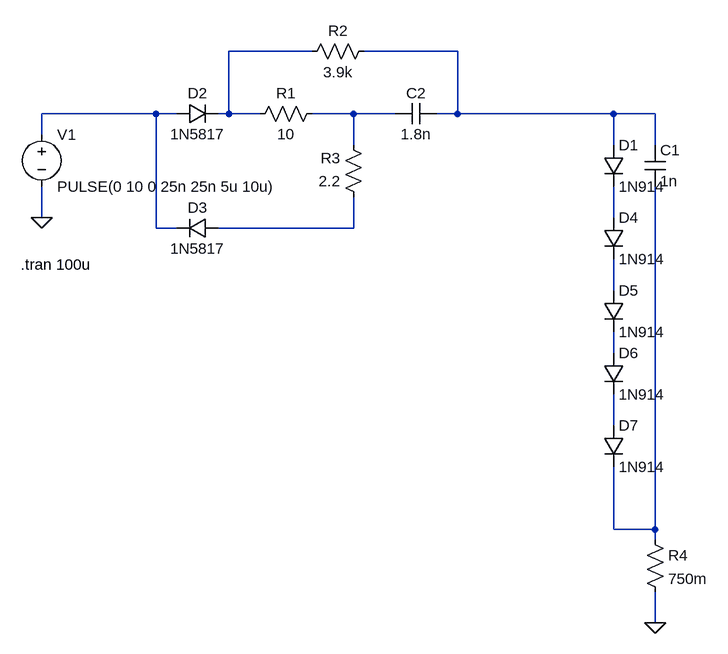
[diagram p0: schematic gate_drive.asc]
gate_drive.asc, the LTspice schematic file:
Version 4.1
SHEET 1 880 868
WIRE -32 -32 -160 -32
WIRE 192 -32 48 -32
WIRE -272 64 -448 64
WIRE -240 64 -272 64
WIRE -160 64 -160 -32
WIRE -160 64 -176 64
WIRE -112 64 -160 64
WIRE 32 64 -32 64
WIRE 96 64 32 64
WIRE 192 64 192 -32
WIRE 192 64 160 64
WIRE 432 64 192 64
WIRE 496 64 432 64
WIRE -448 96 -448 64
WIRE 32 112 32 64
WIRE 432 112 432 64
WIRE 496 112 496 64
WIRE -448 224 -448 176
WIRE 432 224 432 176
WIRE -272 240 -272 64
WIRE -240 240 -272 240
WIRE 32 240 32 192
WIRE 32 240 -176 240
WIRE 432 336 432 288
WIRE 432 432 432 400
WIRE 432 544 432 496
WIRE 432 704 432 608
WIRE 496 704 496 176
WIRE 496 704 432 704
WIRE 496 720 496 704
WIRE 496 848 496 800
FLAG -448 224 0
FLAG 496 848 0
SYMBOL cap 480 112 R0
SYMATTR InstName C1
SYMATTR Value 1n
SYMBOL diode 416 112 R0
SYMATTR InstName D1
SYMATTR Value 1N914
SYMBOL diode -240 80 R270
WINDOW 0 32 32 VTop 2
WINDOW 3 0 32 VBottom 2
SYMATTR InstName D2
SYMATTR Value 1N5817
SYMBOL diode -176 224 R90
WINDOW 0 0 32 VBottom 2
WINDOW 3 32 32 VTop 2
SYMATTR InstName D3
SYMATTR Value 1N5817
SYMBOL res -16 48 R90
WINDOW 0 0 56 VBottom 2
WINDOW 3 32 56 VTop 2
SYMATTR InstName R1
SYMATTR Value 10
SYMBOL res 64 -48 R90
WINDOW 0 0 56 VBottom 2
WINDOW 3 32 56 VTop 2
SYMATTR InstName R2
SYMATTR Value 3.9k
SYMBOL res 48 208 R180
WINDOW 0 36 76 Left 2
WINDOW 3 36 40 Left 2
SYMATTR InstName R3
SYMATTR Value 2.2
SYMBOL cap 160 48 R90
WINDOW 0 0 32 VBottom 2
WINDOW 3 32 32 VTop 2
SYMATTR InstName C2
SYMATTR Value 1.8n
SYMBOL voltage -448 80 R0
WINDOW 123 0 0 Left 0
WINDOW 39 0 0 Left 0
SYMATTR InstName V1
SYMATTR Value PULSE(0 10 0 25n 25n 5u 10u)
SYMBOL diode 416 224 R0
SYMATTR InstName D4
SYMATTR Value 1N914
SYMBOL diode 416 336 R0
SYMATTR InstName D5
SYMATTR Value 1N914
SYMBOL diode 416 432 R0
SYMATTR InstName D6
SYMATTR Value 1N914
SYMBOL diode 416 544 R0
SYMATTR InstName D7
SYMATTR Value 1N914
SYMBOL res 480 704 R0
SYMATTR InstName R4
SYMATTR Value 750m
TEXT -480 296 Left 2 !.tran 100u

The netlist it stands for:
* gate_drive.asc
C1 N002 N010 1n
D1 N002 N005 1N914
D2 N003 N001 1N5817
D3 N006 N003 1N5817
R1 N004 N001 10
R2 N002 N001 3.9k
R3 N006 N004 2.2
C2 N002 N004 1.8n
V1 N003 0 PULSE(0 10 0 25n 25n 5u 10u)
D4 N005 N007 1N914
D5 N007 N008 1N914
D6 N008 N009 1N914
D7 N009 N010 1N914
R4 N010 0 750m
.model D D
.lib standard.dio
.tran 100u
.backanno
.end